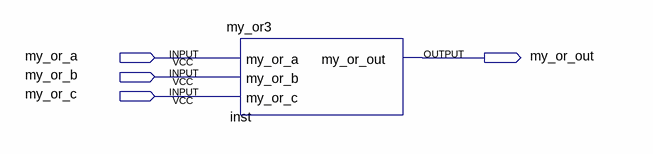
[diagram p0: schematic sheet]
// Quartus schematic main_test5.bdf as structural Verilog: 1 symbols, 4 pins
module main_test5 (
  input  my_or_a,
  input  my_or_b,
  input  my_or_c,
  output my_or_out
);

  my_or3 inst (.my_or_a(my_or_a), .my_or_b(my_or_b), .my_or_c(my_or_c), .my_or_out(my_or_out));
endmodule
